# EAGLE design 5x4-soundboard_328p_TQFP (EAGLE 8.1.0)
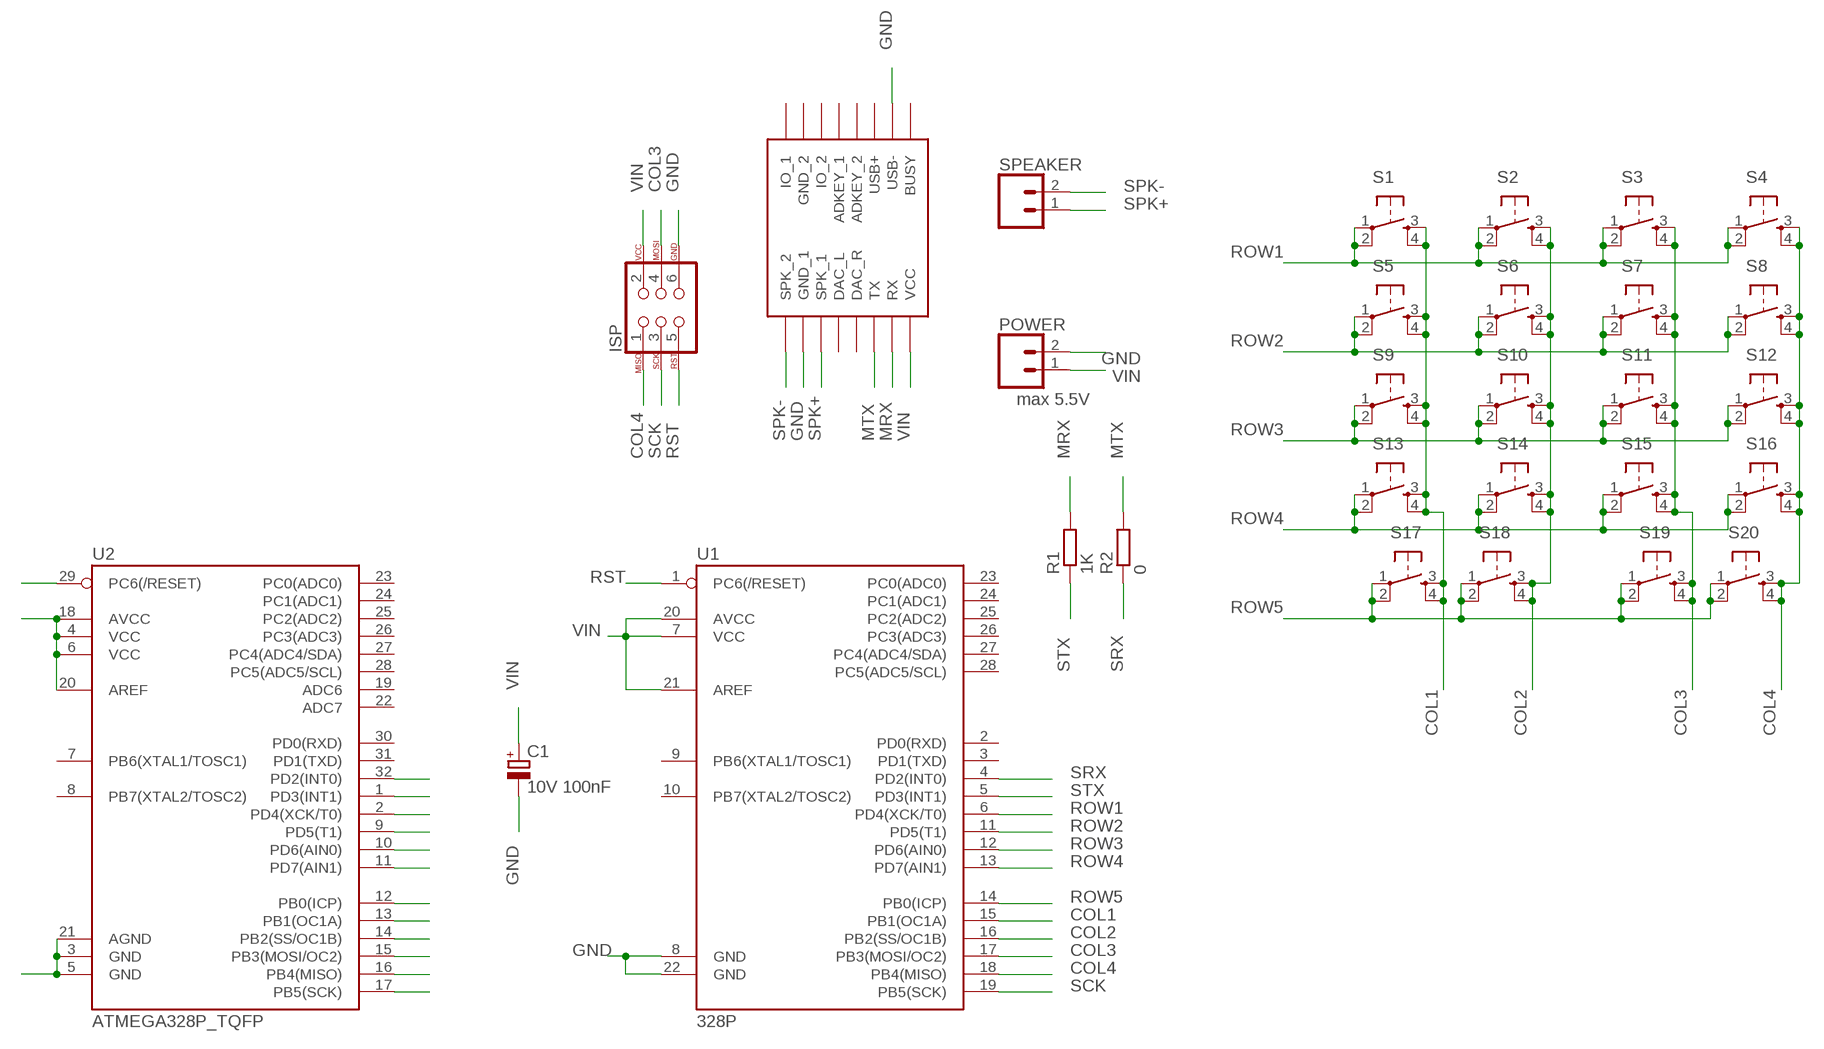
[diagram p0: schematic, sheet 1]

## Parts
C1  10V 100nF  CPOL-EUE5-6  [E5-6]
ISP  AVR_SPI_PROG_3X2PTH  [2X3]
POWER  CONN_02LOCK_LONGPADS  [1X02_LOCK_LONGPADS]
R1  1K  R-EU_0207/10  [0207/10]
R2  0  R-EU_0207/10  [0207/10]
S1  TAC_SWITCHPTH  [TACTILE-PTH]
S2  TAC_SWITCHPTH  [TACTILE-PTH]
S3  TAC_SWITCHPTH  [TACTILE-PTH]
S4  TAC_SWITCHPTH  [TACTILE-PTH]
S5  TAC_SWITCHPTH  [TACTILE-PTH]
S6  TAC_SWITCHPTH  [TACTILE-PTH]
S7  TAC_SWITCHPTH  [TACTILE-PTH]
S8  TAC_SWITCHPTH  [TACTILE-PTH]
S9  TAC_SWITCHPTH  [TACTILE-PTH]
S10  TAC_SWITCHPTH  [TACTILE-PTH]
S11  TAC_SWITCHPTH  [TACTILE-PTH]
S12  TAC_SWITCHPTH  [TACTILE-PTH]
S13  TAC_SWITCHPTH  [TACTILE-PTH]
S14  TAC_SWITCHPTH  [TACTILE-PTH]
S15  TAC_SWITCHPTH  [TACTILE-PTH]
S16  TAC_SWITCHPTH  [TACTILE-PTH]
S17  TAC_SWITCHPTH  [TACTILE-PTH]
S18  TAC_SWITCHPTH  [TACTILE-PTH]
S19  TAC_SWITCHPTH  [TACTILE-PTH]
S20  TAC_SWITCHPTH  [TACTILE-PTH]
SPEAKER  CONN_02LOCK_LONGPADS  [1X02_LOCK_LONGPADS]
U1  328P  ATMEGA328P_PDIP  [DIP28]
U2  ATMEGA328P_TQFP  [TQFP32-08]
U$1  DFPLAYER  [DFPLAYER]

## Nets
COL1: S1.3 S1.4 S5.3 S5.4 S9.3 S9.4 S13.3 S13.4 S17.3 S17.4 U1.15(PB1(OC1A)) U2.13(PB1(OC1A))
COL2: S2.3 S2.4 S6.3 S6.4 S10.3 S10.4 S14.3 S14.4 S18.3 S18.4 U1.16(PB2(SS/OC1B)) U2.14(PB2(SS/OC1B))
COL3: ISP.4 S3.3 S3.4 S7.3 S7.4 S11.3 S11.4 S15.3 S15.4 S19.3 S19.4 U1.17(PB3(MOSI/OC2)) U2.15(PB3(MOSI/OC2))
COL4: ISP.1 S4.3 S4.4 S8.3 S8.4 S12.3 S12.4 S16.3 S16.4 S20.3 S20.4 U1.18(PB4(MISO)) U2.16(PB4(MISO))
GND: C1.- ISP.6 POWER.2 U1.8(GND) U1.22(GND) U2.3(GND) U2.5(GND) U2.21(AGND) U$1.GND_1 U$1.USB-
MRX: R1.2 U$1.RX
MTX: R2.2 U$1.TX
ROW1: S1.1 S1.2 S2.1 S2.2 S3.1 S3.2 S4.1 S4.2 U1.6(PD4(XCK/T0)) U2.2(PD4(XCK/T0))
ROW2: S5.1 S5.2 S6.1 S6.2 S7.1 S7.2 S8.1 S8.2 U1.11(PD5(T1)) U2.9(PD5(T1))
ROW3: S9.1 S9.2 S10.1 S10.2 S11.1 S11.2 S12.1 S12.2 U1.12(PD6(AIN0)) U2.10(PD6(AIN0))
ROW4: S13.1 S13.2 S14.1 S14.2 S15.1 S15.2 S16.1 S16.2 U1.13(PD7(AIN1)) U2.11(PD7(AIN1))
ROW5: S17.1 S17.2 S18.1 S18.2 S19.1 S19.2 S20.1 S20.2 U1.14(PB0(ICP)) U2.12(PB0(ICP))
RST: ISP.5 U1.1(PC6(/RESET)) U2.29(PC6(/RESET))
SCK: ISP.3 U1.19(PB5(SCK)) U2.17(PB5(SCK))
SPK+: SPEAKER.1 U$1.SPK1(SPK_1)
SPK-: SPEAKER.2 U$1.SPK2(SPK_2)
SRX: R2.1 U1.4(PD2(INT0)) U2.32(PD2(INT0))
STX: R1.1 U1.5(PD3(INT1)) U2.1(PD3(INT1))
VIN: C1.+ ISP.2 POWER.1 U1.7(VCC) U1.20(AVCC) U1.21(AREF) U2.4(VCC) U2.6(VCC) U2.18(AVCC) U2.20(AREF) U$1.VCC
Unconnected: U1.2(PD0(RXD)) U1.3(PD1(TXD)) U1.9(PB6(XTAL1/TOSC1)) U1.10(PB7(XTAL2/TOSC2)) U1.23(PC0(ADC0)) U1.24(PC1(ADC1)) U1.25(PC2(ADC2)) U1.26(PC3(ADC3)) U1.27(PC4(ADC4/SDA)) U1.28(PC5(ADC5/SCL)) U2.7(PB6(XTAL1/TOSC1)) U2.8(PB7(XTAL2/TOSC2)) U2.19(ADC6) U2.22(ADC7) U2.23(PC0(ADC0)) U2.24(PC1(ADC1)) U2.25(PC2(ADC2)) U2.26(PC3(ADC3)) U2.27(PC4(ADC4/SDA)) U2.28(PC5(ADC5/SCL)) U2.30(PD0(RXD)) U2.31(PD1(TXD)) U$1.ADKEY1(ADKEY_1) U$1.ADKEY2(ADKEY_2) U$1.BUSY U$1.DAC_L U$1.DAC_R U$1.GND_2 U$1.IO1(IO_1) U$1.IO2(IO_2) U$1.USB+

## Notes on the sheet
- max 5.5V

## Library data of the parts
C1 = rcl:CPOL-EU: POLARIZED CAPACITOR, European symbol
ISP = SparkFun-Connectors:AVR_SPI_PROG_3X2: AVR ISP 6 Pin This is the reduced ISP connector for AVR programming. Common on Arduino. This footprint will take up less PCB space and can be used with a 10-pin to 6-pin adapter such as SKU: BOB-08508 **Special note about "TEST_POINT" package. The stop mask is on the top side, so if you want your programming test points to be on the bottom of your board, make sure to place this package on the bottom side of the board. This also ensure that the orientation to program from the bottom side will be correct. SparkFun Products: SparkFun ISP Pogo Adapter <https://www.sparkfun.com/products/11591> - NS Tiny AVR Programmer <https://www.sparkfun.com/products/11801> -PTH
POWER SPEAKER = SparkFun-Connectors:CONN_02: Multi connection point. Often used as Generic Header-pin footprint for 0.1 inch spaced/style header connections On any of the 0.1 inch spaced packages, you can populate with these: Break Away Headers - Straight <https://www.sparkfun.com/products/116> (PRT-00116) Break Away Male Headers - Right Angle <https://www.sparkfun.com/products/553> (PRT-00553) Female Headers <https://www.sparkfun.com/products/115> (PRT-00115) Break Away Headers - Machine Pin <https://www.sparkfun.com/products/117> (PRT-00117) Break Away Female Headers - Swiss Machine Pin <https://www.sparkfun.com/products/743> (PRT-00743) For SCREWTERMINALS and SPRING TERMINALS visit here: Screw Terimnals on SparkFun.com <https://www.sparkfun.com/search/results?term=Screw+Terminals> (5mm/3.5mm/2.54mm spacing) This device is also useful as a general connection point to wire up your design to another part of your project. Our various solder wires solder well into these plated through hole pads. Hook-Up Wire - Assortment (Stranded, 22 AWG) <https://www.sparkfun.com/products/11375> (PRT-11375) Hook-Up Wire - Assortment (Solid Core, 22 AWG) <https://www.sparkfun.com/products/11367> (PRT-11367) View the entire wire category on our website here <https://www.sparkfun.com/categories/141> Special notes: Molex polarized connector foot print use with: PRT-08233 with associated crimp pins and housings. 2.54_SCREWTERM for use with PRT-10571. 3.5mm Screw Terminal footprints for PRT-08084 5mm Screw Terminal footprints for use with PRT-08432
R1 R2 = resistor:R-EU_: RESISTOR, European symbol
S1-S20 = SparkFun-Retired:TAC_SWITCH: Momentary Switch Button commonly used for reset or general input. Spark Fun Electronics SKU : COM-00097 SMT- SWCH-08247
U1 = SparkFun-IC-Microcontroller:ATMEGA328P_PDIP: Atmel 328P Through hole ATMEGA328P uC used in the Arduino 32kb flash, 1k EEPROM, 2k SRAM Datasheet <http://www.sparkfun.com/datasheets/Components/SMD/ATMega328.pdf> SparkFun Products Storefront component: AVR 28 Pin 20MHz 32K 6A/D - ATMega328P <https://www.sparkfun.com/products/9061> (COM-09061) SparkFun Simon Says - Through-Hole Soldering Kit <https://www.sparkfun.com/products/10547> (KIT-10547) SparkFun Learn to Solder - Simon Says <https://www.sparkfun.com/products/13708> (KIT-13708) SparkFun BigTime Watch Kit <https://www.sparkfun.com/products/11734> (KIT-11734) SparkFun ClockIt <https://www.sparkfun.com/products/10930> (KIT-10930) SparkFun Serial Enabled LCD Kit <https://www.sparkfun.com/products/10097> (LCD-10097) SparkFun Simon Tilts - Through Hole Soldering Kit <https://www.sparkfun.com/products/12634> (KIT-12634) SparkFun Frequency Counter Kit <https://www.sparkfun.com/products/10140> (KIT-10140) FabFM Radio Kit <https://www.sparkfun.com/products/11043> (KIT-11043) SparkFun Binary Blaster Kit <https://www.sparkfun.com/products/12037> (KIT-12037) SparkFun Metro-Gnome <https://www.sparkfun.com/products/9236> (KIT-09236) ATmega328 with Arduino Optiboot (Uno) <https://www.sparkfun.com/products/10524> (DEV-10524); PROD_ID: IC-09136
U2 = SparkFun-IC-Microcontroller:ATMEGA328P_TQFP: Popular 328P in QFP Storefront component: ATmega328 - TQFP <https://www.sparkfun.com/products/13448> (COM-13448) Datasheet <http://www.sparkfun.com/datasheets/Components/SMD/ATMega328.pdf> SparkFun Products SparkFun RedBoard - Programmed with Arduino <https://www.sparkfun.com/products/12757> (DEV-12757) Arduino Pro Mini 328 - 5V/16MHz <https://www.sparkfun.com/products/11113> (DEV-11113) Arduino Pro Mini 328 - 3.3V/8MHz <https://www.sparkfun.com/products/11114> (DEV-11114) SparkFun OpenLog <https://www.sparkfun.com/products/13712> (DEV-13712) SparkFun MicroView - OLED Arduino Module <https://www.sparkfun.com/products/12923> (DEV-12923) SparkFun Digital Sandbox <https://www.sparkfun.com/products/12651> (DEV-12651) SparkFun PicoBoard <https://www.sparkfun.com/products/11888> (WIG-11888) Arduino Fio <https://www.sparkfun.com/products/10116> (DEV-10116) LilyPad Arduino 328 Main Board <https://www.sparkfun.com/products/13342> (DEV-13342) SparkFun RedStick <https://www.sparkfun.com/products/13741> (DEV-13741) LilyPad MP3 <https://www.sparkfun.com/products/11013> (DEV-11013) LilyPad Arduino SimpleSnap <https://www.sparkfun.com/products/10941> (DEV-10941) SparkFun Stepoko <https://www.sparkfun.com/products/13899> (ROB-13899) SparkFun Geiger Counter <https://www.sparkfun.com/products/11345> (SEN-11345) SparkFun EL Sequencer <https://www.sparkfun.com/products/12781> (COM-12781) Arduino Pro 328 - 5V/16MHz <https://www.sparkfun.com/products/10915> (DEV-10915) CryptoCape <https://www.sparkfun.com/products/12773> (DEV-12773) SparkFun IR Thermometer Evaluation Board - MLX90614 <https://www.sparkfun.com/products/10740> (SEN-10740) SparkFun RedBot Mainboard <https://www.sparkfun.com/products/12097> (ROB-12097) Arduino Pro 328 - 3.3V/8MHz <https://www.sparkfun.com/products/10914> (DEV-10914) SparkFun Block for Intel® Edison - Arduino <https://www.sparkfun.com/products/13036> (DEV-13036) SparkFun Simon Says - Surface Mount Soldering Kit <https://www.sparkfun.com/products/10935> (KIT-10935) SparkFun 7-Segment Serial Display - Red <https://www.sparkfun.com/products/11441> (COM-11441) SparkFun 7-Segment Serial Display - White <https://www.sparkfun.com/products/11629> (COM-11629) SparkFun 7-Segment Serial Display - Yellow <https://www.sparkfun.com/products/11443> (COM-11443) SparkFun 7-Segment Serial Display - Kelly Green <https://www.sparkfun.com/products/11440> (COM-11440) SparkFun 7-Segment Serial Display - Blue <https://www.sparkfun.com/products/11442> (COM-11442) SparkFun OpenSegment Serial Display - 20mm (Blue) <https://www.sparkfun.com/products/11647> (COM-11647) SparkFun OpenSegment Serial Display - 20mm (Green) <https://www.sparkfun.com/products/11646> (COM-11646) SparkFun OpenSegment Serial Display - 20mm (White) <https://www.sparkfun.com/products/11648> (COM-11648) SparkFun OpenSegment Serial Display - 20mm (Red) <https://www.sparkfun.com/products/11644> (COM-11644) SparkFun OpenSegment Serial Display - 20mm (Yellow) <https://www.sparkfun.com/products/11645> (COM-11645) SparkFun OpenSegment Shield <https://www.sparkfun.com/products/13190> (DEV-13190); PROD_ID: IC-09069
U$1 = DFPlayer_v1:DFPLAYER

## Board
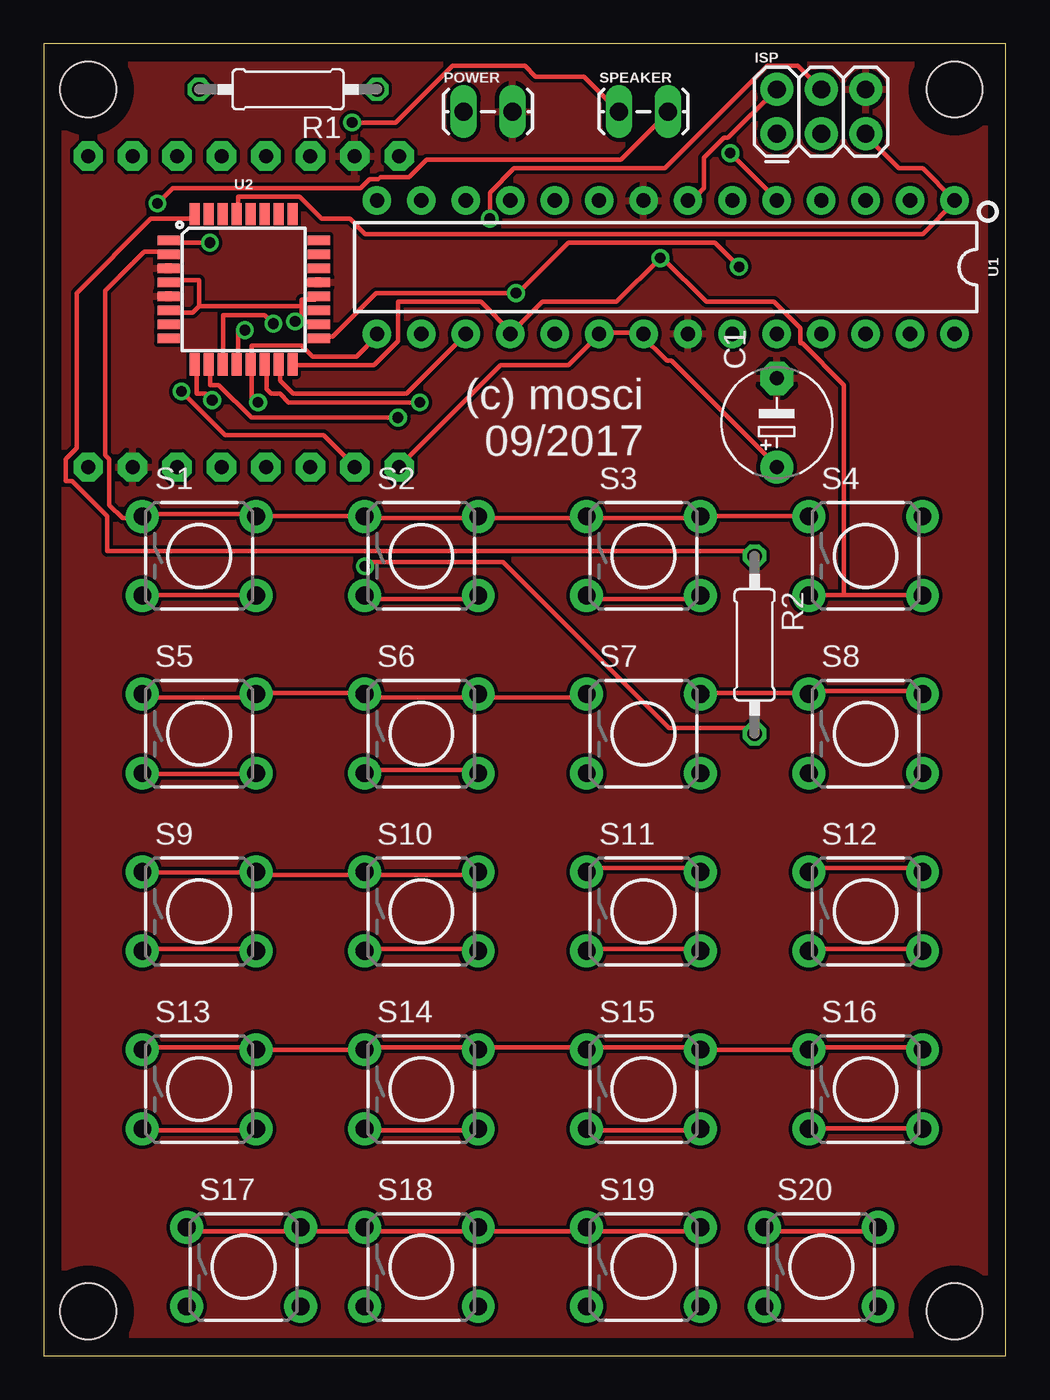
[diagram p1: board, top side]
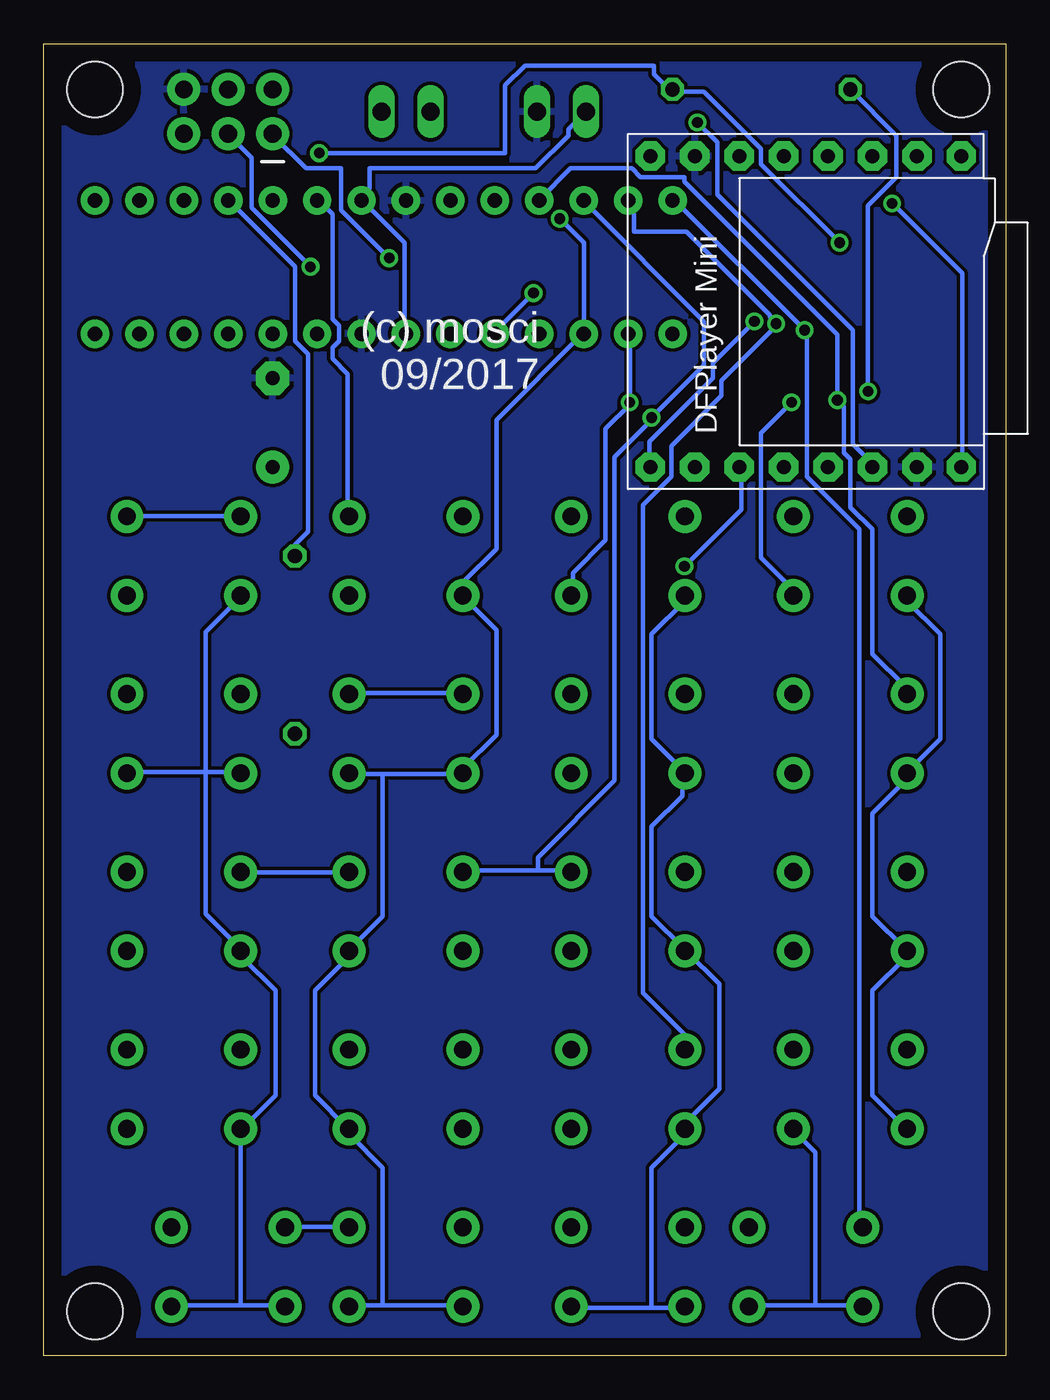
[diagram p2: board, bottom side, seen from below]

Size 55 x 75 mm. Coordinates in mm from the lower left corner, seen from the top.
Outline: 0,0 55,0 55,75 0,75 0,0
Copper layers (1*16): Top 0.035mm / dielectric 1.5mm / Bottom 0.035mm
Design rules "default": minimum track width 10mil, minimum drill 24mil, track to track 8mil, track to pad 8mil, pad to pad 8mil, via to via 8mil, smd to smd 8mil, copper to edge 40mil, drill to drill 8mil, minimum pad ring 10mil, minimum via ring 8mil, stop-mask expansion 4mil, vias tented up to drill 0mil, thermal gap 10mil
Holes 3.2 mm at 2.54,72.39 52.07,72.39 2.54,2.54 52.07,2.54

### Footprints (pad centres in the part's own frame; a part is rotated, then mirrored left to right if it is on the bottom)
E5-6 = drill 0.813 pad 1.905: + -2.54,0 | drill 0.813 pad 1.905 octagon: - 2.54,0
2X3 = drill 1.016 pad 1.88: 1 0,0; 2 0,2.54; 3 2.54,0; 4 2.54,2.54; 5 5.08,0; 6 5.08,2.54
1X02_LOCK_LONGPADS = drill 1.016 long: 1 -0.127,0; 2 2.667,0
0207/10 = drill 0.813 octagon: 1 -5.08,0; 2 5.08,0
TACTILE-PTH = drill 1.016 pad 1.88: 1 -3.251,2.261; 2 3.251,2.261; 3 -3.251,-2.261; 4 3.251,-2.261
DIP28 = drill 0.813 pad 1.626: 1 -16.51,-3.81; 2 -13.97,-3.81; 3 -11.43,-3.81; 4 -8.89,-3.81; 5 -6.35,-3.81; 6 -3.81,-3.81; 7 -1.27,-3.81; 8 1.27,-3.81; 9 3.81,-3.81; 10 6.35,-3.81; 11 8.89,-3.81; 12 11.43,-3.81; 13 13.97,-3.81; 14 16.51,-3.81; 15 16.51,3.81; 16 13.97,3.81; 17 11.43,3.81; 18 8.89,3.81; 19 6.35,3.81; 20 3.81,3.81; 21 1.27,3.81; 22 -1.27,3.81; 23 -3.81,3.81; 24 -6.35,3.81; 25 -8.89,3.81; 26 -11.43,3.81; 27 -13.97,3.81; 28 -16.51,3.81
TQFP32-08 = smd 1.27 x 0.559: 1 -4.293,2.8; 2 -4.293,2; 3 -4.293,1.2; 4 -4.293,0.4; 5 -4.293,-0.4; 6 -4.293,-1.2; 7 -4.293,-2; 8 -4.293,-2.8; 17 4.293,-2.8; 18 4.293,-2; 19 4.293,-1.2; 20 4.293,-0.4; 21 4.293,0.4; 22 4.293,1.2; 23 4.293,2; 24 4.293,2.8 | smd 0.559 x 1.27: 9 -2.8,-4.293; 10 -2,-4.293; 11 -1.2,-4.293; 12 -0.4,-4.293; 13 0.4,-4.293; 14 1.2,-4.293; 15 2,-4.293; 16 2.8,-4.293; 25 2.8,4.293; 26 2,4.293; 27 1.2,4.293; 28 0.4,4.293; 29 -0.4,4.293; 30 -1.2,4.293; 31 -2,4.293; 32 -2.8,4.293
DFPLAYER = drill 0.8 pad 1.676 octagon: ADKEY1 8.89,-1.27; ADKEY2 8.89,1.27; BUSY 8.89,8.89; DAC_L -8.89,-1.27; DAC_R -8.89,1.27; GND_1 -8.89,-6.35; GND_2 8.89,-6.35; IO1 8.89,-8.89; IO2 8.89,-3.81; RX -8.89,6.35; SPK1 -8.89,-3.81; SPK2 -8.89,-8.89; TX -8.89,3.81; USB+ 8.89,3.81; USB- 8.89,6.35; VCC -8.89,8.89

### Placement (x,y rotation side)
C1  41.91,53.34 90 top
ISP  41.91,69.85 0 top
POWER  24.13,71.12 0 top
R1  13.97,72.39 180 top
R2  40.64,40.64 270 top
S1  8.89,45.72 0 top
S2  21.59,45.72 0 top
S3  34.29,45.72 0 top
S4  46.99,45.72 0 top
S5  8.89,35.56 0 top
S6  21.59,35.56 0 top
S7  34.29,35.56 0 top
S8  46.99,35.56 0 top
S9  8.89,25.4 0 top
S10  21.59,25.4 0 top
S11  34.29,25.4 0 top
S12  46.99,25.4 0 top
S13  8.89,15.24 0 top
S14  21.59,15.24 0 top
S15  34.29,15.24 0 top
S16  46.99,15.24 0 top
S17  11.43,5.08 0 top
S18  21.59,5.08 0 top
S19  34.29,5.08 0 top
S20  44.45,5.08 0 top
SPEAKER  33.02,71.12 0 top
U1  35.56,62.23 180 top
U2  11.43,60.96 0 top
U$1  11.43,59.69 90 bottom

### Tracks (layer width: path | path; a pad name or v marks a point on that pad's centre or on a via)
COL1  (via drill 0.61)
  Top 0.254: S13.3 5.75,12.88 12.12,12.88 S13.4 | S9.3 5.75,23.25 12.12,23.25 S9.4 | S5.3 5.75,33.25 12.12,33.25 S5.4 | U1.15 19.12,58.38 17.88,57.12 15.38,57.12 14.75,57.75 11.88,57.75 11.88,56.75 U2.13 11.88,56.62 11.88,54.5 v12.25,54.5 | S1.3 5.75,43.5 12.12,43.5 S1.4
  Bottom 0.254: 10.88,2.88 14.62,2.88 S17.4 | 10.88,2.88 8.25,2.88 S17.3 | 10.88,2.88 10.88,11.62 12.12,12.88 S13.4 | v12.25,54.5 14,52.75 14,45.62 12.25,43.88 12.25,43.5 S1.4 | S1.3 5.62,43.38 5.62,43.12 3.75,41.25 3.75,35.25 5.62,33.38 S5.3 5.75,33.25 5.75,32.88 7.62,31 7.62,25.12 5.75,23.25 S9.3 5.75,23.12 5.75,22.75 7.62,20.88 7.62,14.88 5.75,13 S13.3
COL2  (via drill 0.61)
  Top 0.254: S10.3 18.38,23.25 24.75,23.25 S10.4 | S14.3 18.38,12.88 24.75,12.88 S14.4 | v21.5,54.5 14,54.5 13.5,55 13,55 12.75,55.25 12.75,56.62 U2.14 | S6.3 18.38,33.38 18.5,33.5 24.62,33.5 24.75,33.38 S6.4 | S2.3 18.38,43.38 18.5,43.25 24.62,43.25 24.75,43.38 S2.4
  Bottom 0.254: 20.25,2.75 24.75,2.75 S18.4 | 20.25,2.75 18.38,2.75 S18.3 | 20.25,2.75 20.25,10.75 18.38,12.62 18.38,12.88 S14.3 18.25,13 18.25,13.38 16.38,15.25 16.38,21.25 18.25,23.12 S10.3 18.38,23.25 20.25,25.12 20.25,30.25 18.5,32 18.5,33.38 S6.3 18.38,33.38 20.25,35.25 20.25,41.25 18.38,43.12 18.38,43.38 S2.3 | U1.16 21.5,58.38 v21.5,54.5 21.5,54.38 22.88,53 22.88,46.62 24.75,44.75 24.75,43.5 S2.4
COL3  (via drill 0.61)
  Top 0.254: U2.15 13.5,56.62 13.5,55.75 14.25,55 20.75,55 24.12,58.38 U1.17 | v25.5,65 25.5,66.5 26.88,67.88 35.5,67.88 41.38,73.75 43.12,73.75 44.38,72.5 ISP.4 | S15.3 31.12,12.88 37.5,12.88 S15.4 | S3.3 31.12,43.38 31.25,43.25 37.38,43.25 37.5,43.38 S3.4 | S11.3 31.12,23.25 37.5,23.25 S11.4
  Bottom 0.254: v25.5,65 24.12,63.62 24.12,58.5 U1.17 24.25,58.38 29.12,53.5 29.12,46.12 31,44.25 31,43.5 S3.3 31,43.38 29.12,41.5 29.12,35.5 31,33.62 31,33.38 S7.3 31.12,33.25 35.62,33.25 | 35.62,2.88 37.5,2.88 S19.4 | 35.62,2.88 31.12,2.88 S19.3 | 35.62,2.88 35.62,10.75 37.5,12.62 37.5,12.88 S15.4 37.62,13 39.5,14.88 39.5,20.88 37.62,22.75 37.62,23.12 S11.4 37.5,23.25 35.62,25.12 35.62,33.25 | 35.62,33.25 37.5,33.25 S7.4
COL4  (via drill 0.61)
  Top 0.254: U2.16 14.25,56.62 18.88,56.62 20.25,58 20.25,60.25 25,60.25 26.75,58.5 U1.18 26.75,58.62 26.88,58.62 28.5,60.25 32.75,60.25 v35.25,62.75 35.38,62.75 37.88,60.25 41.75,60.25 43.25,58.75 43.25,57.88 43.38,57.88 45.75,55.5 45.75,43.5 | S16.3 43.75,13 50.12,13 S16.4 | 45.75,43.5 50.12,43.5 S4.4 | 45.75,43.5 43.75,43.5 S4.3 | S12.3 43.75,23.25 50.12,23.25 S12.4
  Bottom 0.254: v35.25,62.75 38,65.5 38,67.88 40,67.88 41.88,69.75 ISP.1 | 43.75,2.88 47.62,2.88 S20.4 | 43.75,2.88 41.25,2.88 S20.3 | 43.75,2.88 43.75,12.88 S16.3 43.62,13 41.75,14.88 41.75,20.88 43.62,22.75 43.62,23.12 S12.3 43.75,23.25 45.75,25.25 45.75,33.38 | 45.75,33.38 50.12,33.38 S8.4 | 45.75,33.38 43.75,33.38 S8.3 | 45.75,33.38 45.75,41.38 43.75,43.38 S4.3
GND
  pour Top: -13.97,88.9 78.74,88.9 78.74,-20.32 -13.97,-20.32
  pour Bottom: -7.62,85.09 69.85,85.09 69.85,83.82 69.85,-11.43 -7.62,-11.43
MRX  (via drill 0.61)
  Top 0.254: v7.88,55.12 10.38,52.62 16,52.62 17.75,50.88 U$1.RX
  Bottom 0.254: R1.2 6.25,69.75 6.25,67.38 7.88,65.75 v7.88,55.12
MTX  (via drill 0.61)
  Top 0.254: v18.38,45.12 18.62,45.38 26.25,45.38 35.75,35.88 40.38,35.88 40.62,35.62 R2.2
  Bottom 0.254: v18.38,45.12 15.12,48.38 15.12,50.75 U$1.TX
ROW1
  Top 0.254: S4.1 43.62,48 37.62,48 S3.2 37.5,47.88 31.12,47.88 S3.1 31,47.88 24.88,47.88 S2.2 24.75,47.88 18.38,47.88 S2.1 18.25,48 12.25,48 S1.2 12.25,48.12 5.88,48.12 5.75,48 S1.1 5.62,47.88 4.5,47.88 3.75,48.62 3.75,51.25 3.5,51.5 3.5,60.88 5.75,63.12 7,63.12 7.12,63 U2.2
  Bottom 0.254: U1.6 39.25,66 38.5,65.25 38.5,59.25 38.12,58.88 38.12,58 38.5,57.62 38.5,57 37.62,56.12 37.62,48 S3.2 | S4.2 50.12,48 43.75,48 S4.1
ROW2  (via drill 0.61)
  Top 0.254: S7.2 37.62,37.88 43.62,37.88 S8.1 43.62,38 50,38 50.12,37.88 S8.2 | S7.1 31,37.75 30.88,37.62 25,37.62 24.88,37.75 S6.2 24.88,37.62 18.5,37.62 18.38,37.75 S6.1 18.25,37.88 12.25,37.88 S5.2 12.12,37.75 12,37.62 5.88,37.62 5.75,37.75 S5.1 | v9.62,54.62 9.25,55 8.75,55 8.75,56.62 U2.9
  Bottom 0.254: S7.2 37.5,37.88 31.12,37.88 S7.1 | S5.1 5.75,37.88 5.75,38.25 7.62,40.12 7.62,47.25 8.88,48.5 8.88,51.25 9.25,51.62 9.25,54.25 v9.62,54.62 9.62,58.38 18.38,67.12 18.38,67.38 20.88,67.38 21.38,67.88 24.88,67.88 26.62,66.12 U1.11
ROW3  (via drill 0.61)
  Top 0.254: v20.25,53.62 11.88,53.62 10,55.5 9.5,55.5 9.5,56.62 U2.10 | S12.2 50.12,27.75 50,27.88 43.88,27.88 43.75,27.75 S12.1 | S9.1 5.75,27.62 12.12,27.62 S9.2 12.12,27.5 18.12,27.5 18.25,27.62 S10.1 18.25,27.5 24.62,27.5 24.75,27.62 S10.2 | S11.2 37.5,27.75 37.38,27.88 31.25,27.88 31.12,27.75 S11.1
  Bottom 0.254: U1.12 24.12,66 17.25,59.12 17.25,56.62 v20.25,53.62 20.25,53.5 22.38,51.38 22.38,32.88 26.75,28.5 26.75,27.75 | S11.2 37.62,27.62 43.62,27.62 S12.1 | 26.75,27.75 31,27.75 S11.1 | 26.75,27.75 24.88,27.75 S10.2
ROW4  (via drill 0.61)
  Top 0.254: v13.12,59 12.62,59.5 10.25,59.5 10.25,56.75 U2.11 | S16.2 50.12,17.62 43.75,17.62 S16.1 43.62,17.5 37.62,17.5 S15.2 37.5,17.62 31.12,17.62 S15.1 31,17.62 24.88,17.62 S14.2 24.75,17.62 18.38,17.62 S14.1 18.25,17.5 12.25,17.5 S13.2 12.12,17.62 5.75,17.62 S13.1
  Bottom 0.254: U1.13 21.62,66 21.62,65.62 21.25,65.25 21.25,64.25 18.25,64.25 13.5,59.5 13.5,59.38 v13.12,59 13.12,58.88 16.25,55.75 16.25,54.88 19.12,52 19.12,50.25 20.75,48.62 20.75,20.75 18.38,18.38 18.38,17.62 S14.1
ROW5  (via drill 0.61)
  Top 0.254: v11.5,58.62 11.12,58.62 11.12,56.75 U2.12 | S20.2 47.62,7.25 47.5,7.12 42.12,7.12 42,7.25 41.25,7.25 S20.1 | S17.1 8.25,7.25 8.38,7.12 13.75,7.12 13.88,7.25 14.62,7.25 S17.2 14.62,7.12 18.12,7.12 18.25,7.25 S18.1 18.25,7.12 24.62,7.12 24.75,7.25 S18.2 24.75,7.12 30.88,7.12 31,7.25 S19.1 31,7.12 37.38,7.12 37.5,7.25 S19.2
  Bottom 0.254: U1.14 19,66.12 v11.5,58.62 11.5,58.5 11.38,58.38 11.38,50.25 8.38,47.25 8.38,7.5 8.25,7.38 S17.1 | S19.2 37.62,7.38 41.12,7.38 S20.1
RST
  Top 0.254: U2.29 11.12,65.38 11.12,66.25 14.62,66.25 15.88,65 17.5,65 18.38,64.12 50.25,64.12 52.12,66 U1.1 52,66.12 50.25,67.88 48.88,67.88 47,69.75 ISP.5
SCK  (via drill 0.61)
  Top 0.254: U2.17 15.75,58.25 16.5,58.25 19,60.75 v27,60.75 27.12,60.75 30,63.62 38.38,63.62 v39.75,62.25
  Bottom 0.254: v27,60.75 29.12,58.62 29.12,58.5 U1.19 | v39.75,62.25 43.12,65.62 43.12,68.5 44.38,69.75 ISP.3
SPK+  (via drill 0.61)
  Top 0.254: v17.62,70.5 20.12,70.5 23.38,73.75 27.5,73.75 28.12,73.12 30.88,73.12 32.88,71.12 SPEAKER.1
  Bottom 0.254: v17.62,70.5 16.5,69.38 16.5,66.38 8.75,58.62 8.75,52.12 7.62,51 7.62,50.88 U$1.SPK1
SPK-  (via drill 0.61)
  Top 0.254: v6.5,65.88 7.38,66.75 18.12,66.75 18.62,67.25 19.12,67.25 19.25,67.38 20.88,67.38 21.88,68.38 33,68.38 35.62,71 SPEAKER.2
  Bottom 0.254: v6.5,65.88 2.5,61.88 2.5,50.88 U$1.SPK2
SRX
  Top 0.254: U2.32 8.38,65 6.12,65 1.88,60.75 1.88,51.88 1.25,51.25 1.25,50 1.62,50 3.62,48 3.62,46 40,46 40.25,45.75 40.62,45.75 R2.1
  Bottom 0.254: U1.4 44.38,66 40.62,62.25 40.62,58 39.88,57.25 39.88,47.12 40.62,46.38 40.62,45.75 R2.1
STX  (via drill 0.61)
  Top 0.254: v9.5,63.62 7.38,63.62 7.25,63.75 U2.1 | v39.25,68.75 41.88,66.12 U1.5
  Bottom 0.254: v9.5,63.62 14,68.12 14,69 17.25,72.25 19,72.25 19,72.38 R1.1 19.12,72.25 20.12,73.25 20.12,73.75 27.5,73.75 28.62,72.62 28.62,68.75 v39.25,68.75
VIN  (via drill 0.61)
  Top 0.254: ISP.2 41.88,72.38 39.12,69.62 38.88,69.62 37.75,68.5 37.75,66.75 37.12,66.12 36.88,66.12 U1.7 | 14.75,59.25 14.88,59.12 15.5,59.12 15.62,59 U2.18 | 14.75,60 14.75,60.38 15.5,60.38 15.62,60.5 U2.20 | 14.75,60 14.75,59.25 | 8.88,60 8.5,59.62 7.38,59.62 7.25,59.75 U2.6 | 8.88,60 8.88,61.5 7.38,61.5 7.25,61.38 U2.4 | 8.88,60 14.75,60 | U$1.VCC 20.38,50.88 26.12,56.62 30,56.62 31.75,58.38 U1.20 31.75,58.5 34.25,58.5 U1.21 34.12,58.38 35.62,56.88 35.88,56.88 41.88,50.88 C1.+ | v14.38,59.12 14.5,59.12 14.62,59.25 14.75,59.25
  Bottom 0.254: POWER.1 24.12,71 25,70.12 25,69.75 26.88,67.88 36.38,67.88 36.38,66.75 36.75,66.38 36.75,66.12 U1.7 36.75,66 34.38,63.62 34.38,58.5 U1.21 | v14.38,59.12 16.75,56.75 16.75,55.88 20.38,52.25 20.38,50.88 U$1.VCC

### Text on the board
tNames: (c) mosci / 09/2017
bNames: (c) mosci / 09/2017